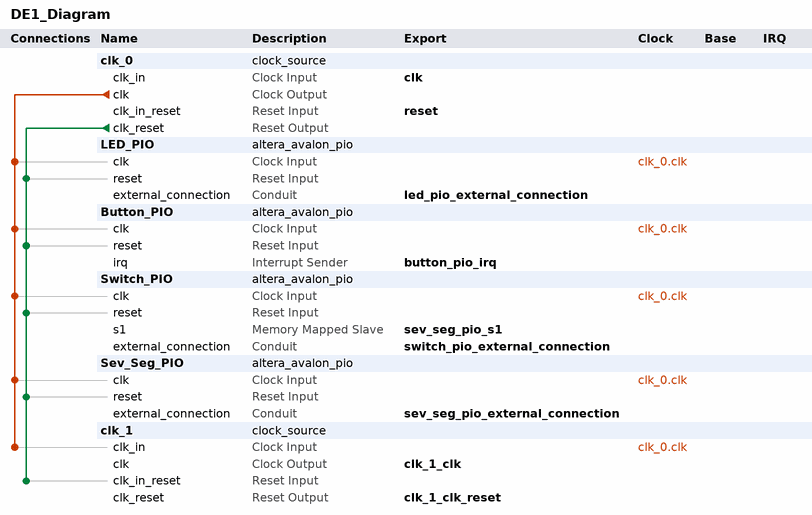
[diagram p0: system contents]
# Platform Designer (Qsys) system DE1_Diagram, Cyclone V 5CSEMA5F31C6
# Parameters at their usual value, and those the tool derives, are not listed.
package require -exact qsys 18.1
create_system DE1_Diagram
set_project_property DEVICE_FAMILY {Cyclone V}
set_project_property DEVICE 5CSEMA5F31C6

add_instance clk_0 clock_source 18.1
set_instance_parameter_value clk_0 clockFrequency 50000000

add_instance LED_PIO altera_avalon_pio 18.1
set_instance_parameter_value LED_PIO direction Output
set_instance_parameter_value LED_PIO width 8

add_instance Button_PIO altera_avalon_pio 18.1
set_instance_parameter_value Button_PIO captureEdge true
set_instance_parameter_value Button_PIO direction Input
set_instance_parameter_value Button_PIO generateIRQ true
set_instance_parameter_value Button_PIO irqType EDGE
set_instance_parameter_value Button_PIO width 4

add_instance Switch_PIO altera_avalon_pio 18.1
set_instance_parameter_value Switch_PIO direction Input
set_instance_parameter_value Switch_PIO width 8

add_instance Sev_Seg_PIO altera_avalon_pio 18.1
set_instance_parameter_value Sev_Seg_PIO direction Output
set_instance_parameter_value Sev_Seg_PIO width 28

add_instance clk_1 clock_source 18.1
set_instance_parameter_value clk_1 clockFrequency 50000000

# connections
add_connection clk_0.clk Button_PIO.clk clock
add_connection clk_0.clk clk_1.clk_in clock
add_connection clk_0.clk LED_PIO.clk clock
add_connection clk_0.clk Sev_Seg_PIO.clk clock
add_connection clk_0.clk Switch_PIO.clk clock
add_connection clk_0.clk_reset Button_PIO.reset reset
add_connection clk_0.clk_reset clk_1.clk_in_reset reset
add_connection clk_0.clk_reset LED_PIO.reset reset
add_connection clk_0.clk_reset Sev_Seg_PIO.reset reset
add_connection clk_0.clk_reset Switch_PIO.reset reset

# exported interfaces
add_interface button_pio_irq interrupt sender
set_interface_property button_pio_irq EXPORT_OF Button_PIO.irq
add_interface clk clock sink
set_interface_property clk EXPORT_OF clk_0.clk_in
add_interface clk_1_clk clock source
set_interface_property clk_1_clk EXPORT_OF clk_1.clk
add_interface clk_1_clk_reset reset source
set_interface_property clk_1_clk_reset EXPORT_OF clk_1.clk_reset
add_interface led_pio_external_connection conduit end
set_interface_property led_pio_external_connection EXPORT_OF LED_PIO.external_connection
add_interface reset reset sink
set_interface_property reset EXPORT_OF clk_0.clk_in_reset
add_interface sev_seg_pio_external_connection conduit end
set_interface_property sev_seg_pio_external_connection EXPORT_OF Sev_Seg_PIO.external_connection
add_interface sev_seg_pio_s1 avalon slave
set_interface_property sev_seg_pio_s1 EXPORT_OF Switch_PIO.s1
add_interface switch_pio_external_connection conduit end
set_interface_property switch_pio_external_connection EXPORT_OF Switch_PIO.external_connection

set_interconnect_requirement {$system} qsys_mm.clockCrossingAdapter HANDSHAKE
set_interconnect_requirement {$system} qsys_mm.enableEccProtection FALSE
set_interconnect_requirement {$system} qsys_mm.insertDefaultSlave FALSE
set_interconnect_requirement {$system} qsys_mm.maxAdditionalLatency 1

save_system DE1_Diagram.qsys
